# EAGLE design CSPB_Adapter (EAGLE 9.5.1)
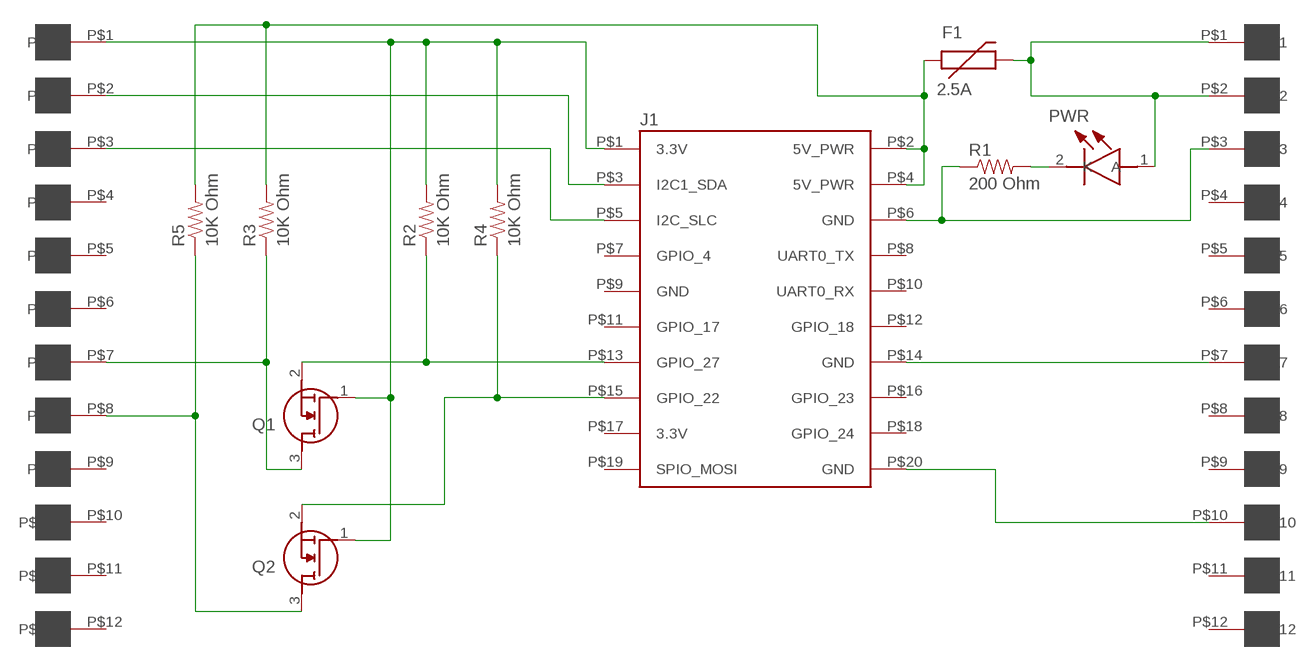
[diagram p0: schematic, sheet 1]

## Parts
F1  2.5A  MF-MSMF250/16X-2  [F1812]
J1  PPTC052LFBN-RC  PPTC052LFBN-RC-BOTTOM  [2X10_TH_HEADER_BOTTOM]
J2  12_POS_BOARD_EDGE_PADS  [CARD_EDGE_12_POS_0.1_IN]
J3  12_POS_BOARD_EDGE_PADS  [CARD_EDGE_12_POS_0.1_IN]
PWR  LTST-S220KGKT  [LTSTS220KGKT]
Q1  BSS138  [SOT95P240X120-3N]
Q2  BSS138  [SOT95P240X120-3N]
R1  200 Ohm  RESISTOR0402-RES  [0402-RES]
R2  10K Ohm  RESISTOR0402-RES  [0402-RES]
R3  10K Ohm  RESISTOR0402-RES  [0402-RES]
R4  10K Ohm  RESISTOR0402-RES  [0402-RES]
R5  10K Ohm  RESISTOR0402-RES  [0402-RES]

## Nets
3.3V: J1.P$1(3.3V) J2.P$1 Q1.1(G) Q2.1(G) R2.2 R4.2
5V: F1.2 J3.P$1 J3.P$2 PWR.1(A)
GND: J1.P$6(GND) J1.P$14(GND) J1.P$20(GND) J3.P$3 J3.P$7 J3.P$10 R1.1
MONITOR: J2.P$8 Q2.3(D) R5.1
MONITOR_PI: J1.P$15(GPIO_22) Q2.2(S) R4.1
N$4: F1.1 J1.P$2(5V_PWR) J1.P$4(5V_PWR) R3.2 R5.2
N$14: PWR.2(K) R1.2
SDA: J1.P$3(I2C1_SDA) J2.P$2
SHUTDOWN: J2.P$7 Q1.3(D) R3.1
SHUTDOWN_PI: J1.P$13(GPIO_27) Q1.2(S) R2.1
SLC: J1.P$5(I2C_SLC) J2.P$3
Unconnected: J1.P$7(GPIO_4) J1.P$8(UART0_TX) J1.P$10(UART0_RX) J1.P$11(GPIO_17) J1.P$12(GPIO_18) J1.P$16(GPIO_23) J1.P$17(3.3V) J1.P$18(GPIO_24) J1.P$19(SPIO_MOSI) J2.P$4 J2.P$5 J2.P$6 J2.P$9 J2.P$10 J2.P$11 J2.P$12 J3.P$4 J3.P$5 J3.P$6 J3.P$8 J3.P$9 J3.P$11 J3.P$12

## Power pins joined to a net without a drawn wire
GND: J1.P$9(GND)

## Library data of the parts
F1 = Jerry-Master-Lib:MF-MSMF250/16X-2: Bourns Inc. MF-MSMF250/16X-2 2.5 A PTC Resettable Fuse Datasheet <http://www.bourns.com/docs/Product-Datasheets/mfmsmf.pdf> Newark <http://www.newark.com/bourns/mf-msmf250-16x-2/fuse-ptc-resettable-16v-100a-1812/dp/05R7837?ost=MF-MSMF250%2F16X-2&selectedCategoryId=&categoryNameResp=All%2BCategories&searchView=table&iscrfnonsku=false> Digi-key <http://www.digikey.com/product-search/en?keywords=MF-MSMF250%2F16X-2> Mouser <http://www.mouser.com/ProductDetail/Bourns/MF-MSMF250-16X-2/?qs=9fn1gpisni78zr7pGyDhCQ%3D%3D> Allied Electronics <http://www.alliedelec.com/bourns-mf-msmf250-16x-2/70153471/>
J1 = Jerry-Master-Lib:PPTC052LFBN-RC-BOTTOM: WRONG FOOT PRINT AND SCHEMATIC!!! Sullins Connector Solutions PPTC052LFBN-RC 10 Position Header Connector, 0.100" (2.54mm), Through Hole, Tin, 8.50mm High
J2 J3 = Jerry-Master-Lib:12_POS_BOARD_EDGE_PADS: 12 .065"x.136" card edge pads.
PWR = LTST-S220KGKT:LTST-S220KGKT: LTST-S220KGKT, Lite-On 571 nm Green LED, 2012 (0805) Side View SMD package Source: Datasheet <https://optoelectronics.liteon.com/upload/download/DS22-2000-075/LTST-S220KGKT.pdf>
Q1 Q2 = BSS138:BSS138: N-channel MOSFET,BSS138 0.2A 50V Source: Datasheet <https://www.onsemi.com/pub/Collateral/BSS138-D.PDF>
R1-R5 = SparkFun:RESISTOR: Resistor Basic schematic elements and footprints for 0603, 1206, and PTH resistors.

## Board
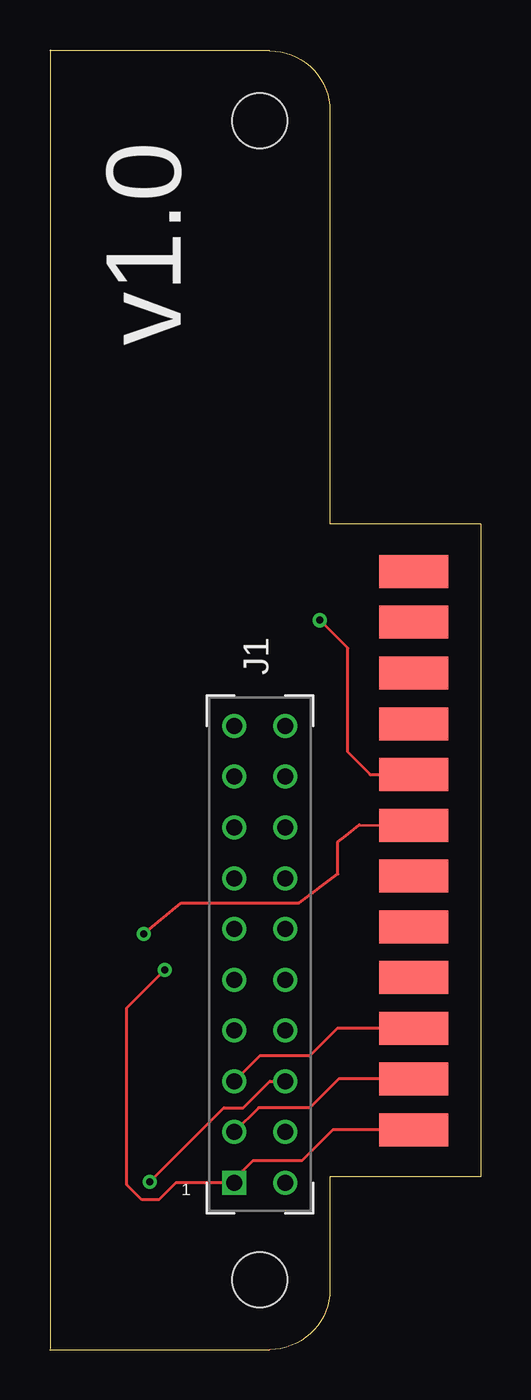
[diagram p1: board, top side]
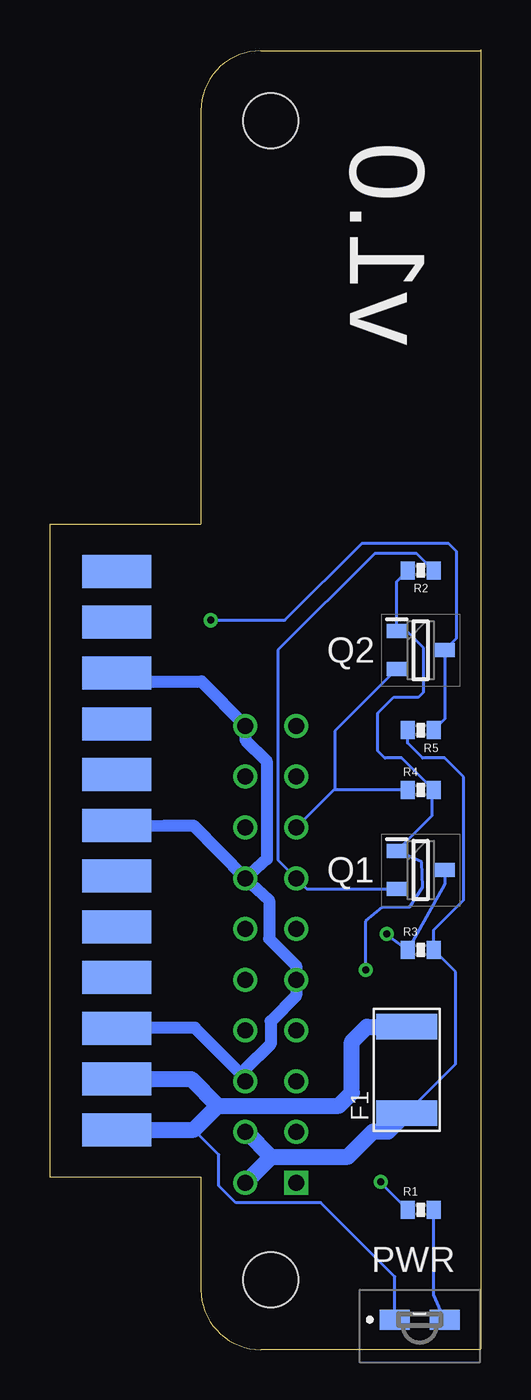
[diagram p2: board, bottom side, seen from below]

Size 21.55 x 65.04 mm. Coordinates in mm from the lower left corner, seen from the top.
Outline: 0,65 11,65 arc-90 14,62
Outline: 14,3 arc-90 11,0 0,0
Outline: 0.01,65.04 0.01,0.04
Outline: 14.01,62.04 14.01,41.31 21.55,41.31 21.55,8.65 14.01,8.65 14.01,3.02
Copper layers (1*16): Top 0.0356mm / dielectric 1.5011mm / Bottom 0.0356mm
Design rules "oshpark-2layer": minimum track width 6mil, minimum drill 13mil, track to track 6mil, track to pad 6mil, pad to pad 6mil, via to via 6mil, smd to smd 6mil, copper to edge 15mil, drill to drill 6mil, minimum pad ring 7mil, minimum via ring 7mil, stop-mask expansion 2.5mil, vias tented up to drill 0mil, thermal gap 10mil
Holes 2.75 mm at 10.5,3.5 10.5,61.5
tRestrict: area 7.5,58.5 to 13.5,64.5; area 7.5,0.5 to 13.5,6.5
bRestrict: area 7.5,58.5 to 13.5,64.5; area 7.5,0.5 to 13.5,6.5; area 7.5,58.5 to 13.5,64.5

### Footprints (pad centres in the part's own frame; a part is rotated, then mirrored left to right if it is on the bottom)
F1812 = smd 1.27 x 3.048: 1 -2.159,0; 2 2.159,0
2X10_TH_HEADER_BOTTOM = drill 0.8 square: P$1 -1.27,-11.43 | drill 0.8: P$2 1.27,-11.43; P$3 -1.27,-8.89; P$4 1.27,-8.89; P$5 -1.27,-6.35; P$6 1.27,-6.35; P$7 -1.27,-3.81; P$8 1.27,-3.81; P$9 -1.27,-1.27; P$10 1.27,-1.27; P$11 -1.27,1.27; P$12 1.27,1.27; P$13 -1.27,3.809; P$14 1.27,3.81; P$15 -1.27,6.35; P$16 1.27,6.35; P$17 -1.27,8.89; P$18 1.27,8.89; P$19 -1.27,11.43; P$20 1.27,11.43
CARD_EDGE_12_POS_0.1_IN = smd 1.651 x 3.454: P$1 0,0; P$2 2.54,0; P$3 5.08,0; P$4 7.62,0; P$5 10.16,0; P$6 12.7,0; P$7 15.24,0; P$8 17.78,0; P$9 20.32,0; P$10 22.86,0; P$11 25.4,0; P$12 27.94,0
LTSTS220KGKT = smd 1 x 1.5: 1 0,1.25; 2 0,-1.25
SOT95P240X120-3N = smd 1 x 0.7: 1 -1.2,0.95; 2 -1.2,-0.95; 3 1.2,0
0402-RES = smd 0.7 x 0.9: 1 -0.65,0; 2 0.65,0

### Placement (x,y rotation side)
F1  3.7,14 90 bottom
J1  10.5,19.78 0 top
J2  18.2,11 90 top
J3  18.2,11 90 bottom
PWR  3.05,1.5 90 bottom
Q1  3,24 0 bottom
Q2  3,35 0 bottom
R1  3,7 0 bottom
R2  3,39 180 bottom
R3  3,20 0 bottom
R4  3,28 0 bottom
R5  3,31 180 bottom

### Tracks (layer width: path | path; a pad name or v marks a point on that pad's centre or on a via)
3.3V  (via drill 0.35)
  Top 0.152: J2.P$1 14.15,11 12.6,9.45 10.15,9.45 9.23,8.53 J1.P$1 6.3,8.35 5.45,7.5 4.6,7.5 3.85,8.25 3.85,17.1 v5.75,19
  Bottom 0.152: R2.2 4.2,38.45 Q2.1 3.7,35.95 2.85,35.1 2.85,32.9 3.1,32.65 4.35,32.65 5.15,31.85 5.15,29.95 4.8,29.6 3.95,29.6 R4.2 2.45,27.9 2.45,26.7 Q1.1 2.95,24.4 2.9,23.15 3.55,22.15 4.9,22.15 5.75,21.45 v5.75,19
5V
  Bottom 0.152: PWR.1 4.3,3.65 8,7.35 12.25,7.35 13.1,8.2 13.1,9.75 14.35,11
  Bottom 0.813: J3.P$1 14.35,11 13.15,12.2 | 13.15,12.2 7.1,12.2 6.45,12.85 6.45,15.4 5.69,16.16 F1.2 | J3.P$2 14.49,13.54 13.15,12.2
GND  (via drill 0.35)
  Top 0.152: v5,8.4 8.7,12.1 9.67,12.1 11,13.43 J1.P$6
  Bottom 0.152: R1.1 5,8.35 v5,8.4 | 17.82,26.21 18.12,26.21 J3.P$7 | 17.82,33.83 18.12,33.83 J3.P$10
  Bottom 0.61: J3.P$3 18.18,16.1 14.3,16.1 11.77,13.57 J1.P$6 11.77,14.03 10.51,15.28 10.51,16.43 9.23,17.71 J1.P$9 9.23,19.2 10.59,20.56 10.59,22.49 10.6,22.5 J1.P$14 | 17.82,26.21 15.83,26.22 14.38,26.22 J1.P$14 | 17.82,33.83 16.83,33.44 13.98,33.44 J1.P$20 11.77,30.52 10.71,29.46 10.71,24.56 10.7,24.55 J1.P$14
MONITOR  (via drill 0.35)
  Top 0.152: J2.P$8 16.02,28.78 14.9,29.9 14.9,35.1 v13.5,36.5
  Bottom 0.152: R5.1 1.8,31.55 Q2.3 1.2,35.6 1.2,39.95 1.6,40.35 5.95,40.35 9.8,36.5 v13.5,36.5
MONITOR_PI
  Bottom 0.152: R4.1 7.36,28 J1.P$15 7.3,28.06 7.3,30.95 Q2.2
N$4
  Bottom 0.152: F1.1 1.25,14.29 1.25,18.9 R3.2 2.35,21 0.85,22.5 0.85,28.65 1.8,29.6 2.9,29.6 3.65,30.35 R5.2
  Bottom 0.813: J1.P$2 10.47,9.65 | F1.1 4.63,10.91 5.38,10.91 6.64,9.65 10.47,9.65 | J1.P$4 11.71,10.89 10.47,9.65
N$14
  Bottom 0.152: PWR.2 2.35,2.75 R1.2
SDA
  Top 0.152: J2.P$2 14.44,13.54 13,12.1 10.44,12.1 J1.P$3
SHUTDOWN  (via drill 0.35)
  Top 0.152: v4.7,20.8 6.57,22.35 12.47,22.35 14.4,23.8 14.4,25.41 14.79,25.71 15.48,26.26 J2.P$7
  Bottom 0.152: v4.7,20.8 4.75,20.8 R3.1 1.8,23.3 Q1.3
SHUTDOWN_PI
  Bottom 0.152: Q1.2 8.69,23.05 J1.P$13 10.15,24.51 10.15,35 5.3,39.85 3.2,39.85 R2.1
SLC
  Top 0.152: J2.P$3 14.38,16.08 13,14.7 10.5,14.7 J1.P$5

### Text on the board
tPlace: v1.0
bPlace: v1.0